# Altium project RX_BA_V4.PrjPcb
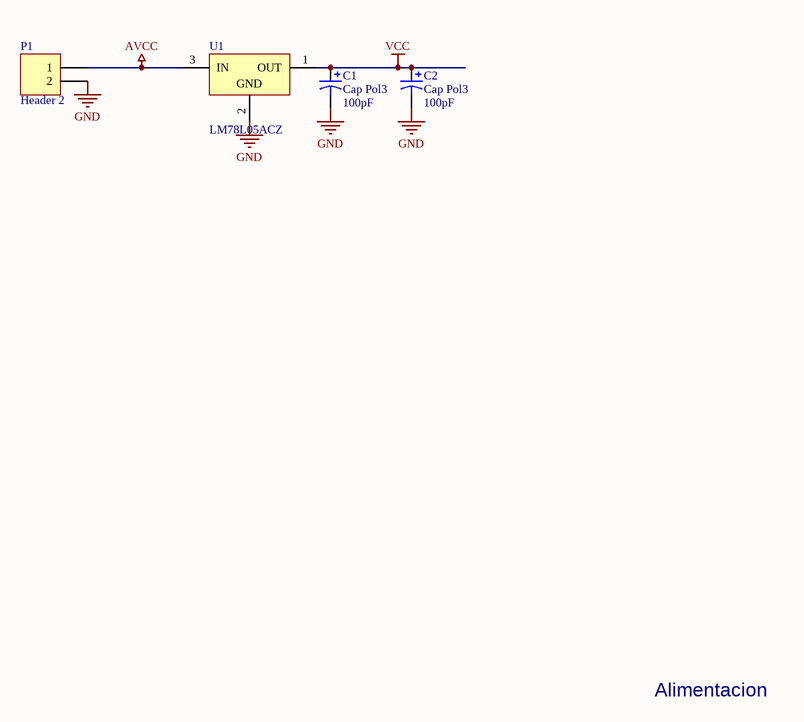
[diagram p0: Alimentacion.SchDoc]
Title: Receptor de Banda Aerea
8 sheets, 175 parts. Net scope: global (net labels, ports and power ports of the same name join across sheets).
Board file: RX_BA_v4.PcbDoc
Sheets:
  Alimentacion.SchDoc
  AmpliRF.SchDoc
  FiltroRF.SchDoc
  Mezclador1.SchDoc
  Mezclador2.SchDoc
  Ampli_FI2.SchDoc
  Ampli_audio.SchDoc
  Control_Freq.SchDoc

## Sheet Alimentacion.SchDoc: Receptor de Banda Aerea
size A4

### Parts
C1  Cap Pol3  value 100pF  [C0805]
C2  Cap Pol3  value 100pF  [C0805]
P1  Header 2  [HDR1X2]
U1  LM78L05ACZ  [BCY-W3]

### Nets
AVCC: P1.1 U1.3(IN)
GND: C1.2 C2.2 P1.2 U1.2(GND)
VCC: C1.1 C2.1 U1.1(OUT)

### Notes on the sheet
- Alimentacion

### Library data of the parts
C1 C2 = Cap Pol3: Polarized Capacitor (Surface Mount); Published: 8-Jun-2000; LatestRevisionDate: 17-Jul-2002; LatestRevisionNote: Re-released for DXP Platform.; PackageReference: C0805; Publisher: Altium Limited
P1 = Header 2: Header, 2-Pin; LatestRevisionDate: 17-Jul-2002; LatestRevisionNote: Re-released for DXP Platform.; Publisher: Altium Limited
U1 = LM78L05ACZ: 3-Terminal Positive Regulators; Manufacturer: National Semiconductor; CompType: LDO IC; PackageTopMarking: NSXYTT*LM78L*05ACZ; Published: 27-Nov-2008; DatasheetVersion: Apr-2006; PackageVersion: revG, Sep-2000; PackageReference: Z03A; Publisher: Altium Limited; PackageDescription: TO-92, Molded, 3 Lead; PartNumber: LM78L05ACZ; RoHS: O; PinCount: 3; DigiKeyPartNumber: LM78L05ACZNS-ND; Code_JEDEC: TO-226-AA; ComponentLink1Description: LM78L05 Datasheet; ComponentLink1URL: http://www.national.com/ds/LM/LM78L05.pdf; ComponentLink2Description: LM78L05 Web Page; ComponentLink2URL: http://www.national.com/pf/LM/LM78L05.html; ComponentLink3Description: Z03A Package Page; ComponentLink3URL: http://www.national.com/packaging/folders/z03a.html

## Sheet AmpliRF.SchDoc: Receptor de Banda Aerea
size A4
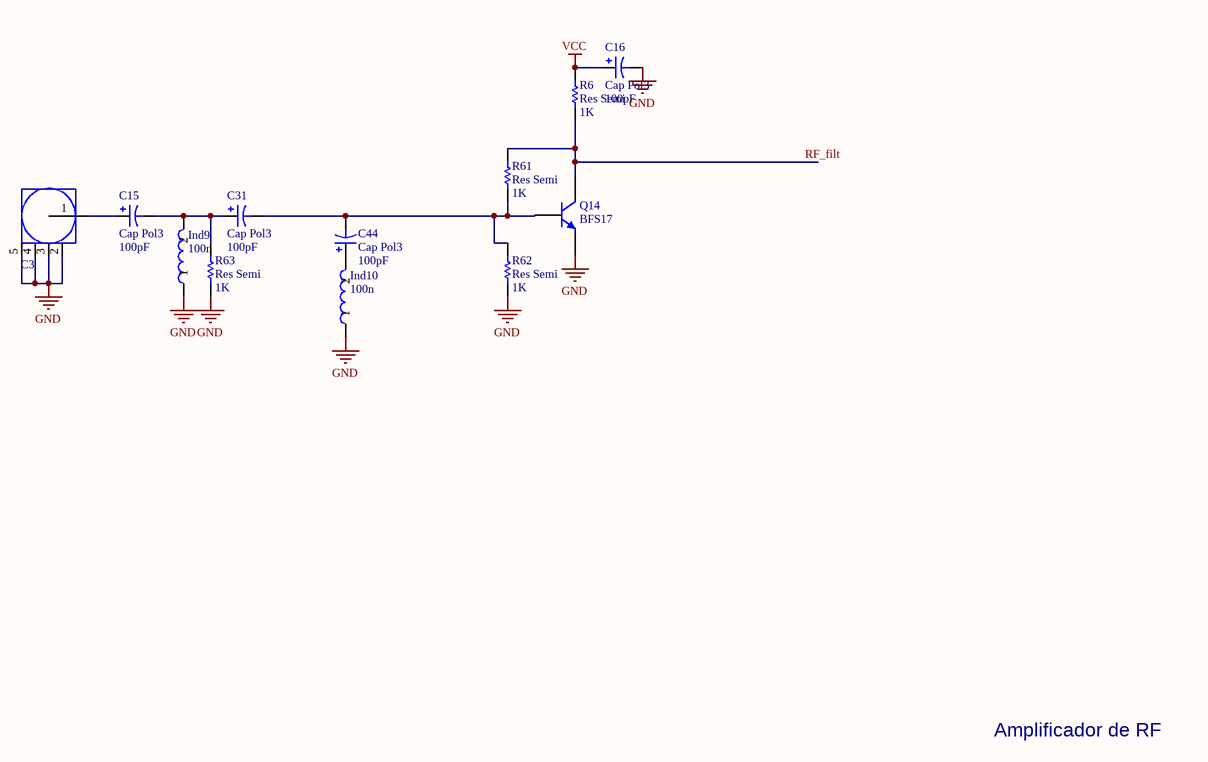
[diagram p1: AmpliRF.SchDoc]

### Parts
C3  SMA  [SMA1]  (value not drawn)
C15  Cap Pol3  value 100pF  [C0805]
C16  Cap Pol3  value 100pF  [C0805]
C31  Cap Pol3  value 100pF  [C0805]
C44  Cap Pol3  value 100pF  [C0805]
Ind9  Valor: 100n  [Ind_4mm]  (hidden comment: Ind2)
Ind10  Valor: 100n  [Ind_4mm]  (hidden comment: Ind2)
Q14  BFS17  [SOT-23]
R6  Res Semi  value 1K  [2012[0805]]
R61  Res Semi  value 1K  [2012[0805]]
R62  Res Semi  value 1K  [2012[0805]]
R63  Res Semi  value 1K  [2012[0805]]

### Nets
GND: C3.2(GND) C3.3(GND) C3.4(GND) C3.5(GND) C16.2 Ind9.1 Ind10.1 Q14.2(E) R62.2 R63.2
VCC: C16.1 R6.1
RF_filt: Q14.3(C) R6.2 R61.1
NetC3_1: C3.1(RF) C15.1
NetC15_2: C15.2 C31.1 Ind9.2 R63.1
NetC31_2: C31.2 C44.2 Q14.1(B) R61.2 R62.1
NetC44_1: C44.1 Ind10.2

### Notes on the sheet
- Amplificador de RF

### Library data of the parts
C15 C16 C31 C44 = Cap Pol3: Polarized Capacitor (Surface Mount); Published: 8-Jun-2000; LatestRevisionDate: 17-Jul-2002; LatestRevisionNote: Re-released for DXP Platform.; PackageReference: C0805; Publisher: Altium Limited
Q14 = BFS17: NPN 1 GHz Wideband Transistor; Published: 17-Sep-2003; LatestRevisionDate: 12-Dec-2006; LatestRevisionNote: IPC-7351 Footprint Added.; DatasheetVersion: Sep-1995; PackageVersion: May-1999; PackageReference: SOT23; Publisher: Altium Limited; PackageDescription: 3-Pin SOT-23 Package 0.95 mm Pitch, 2.3 mm Lead Span; ComponentLink1Description: Manufacturer Link; ComponentLink1URL: http://www.semiconductors.philips.com/; ComponentLink2Description: Datasheet; ComponentLink2URL: http://www.semiconductors.philips.com/acrobat/datasheets/BFS17_2.pdf
R6 R61-R63 = Res Semi: Semiconductor Resistor; Published: 8-Jun-2000; LatestRevisionDate: 17-Jul-2002; LatestRevisionNote: Re-released for DXP Platform.; PackageReference: AXIAL-0.5; Publisher: Altium Limited

## Sheet FiltroRF.SchDoc: Receptor de Banda Aerea
size A4
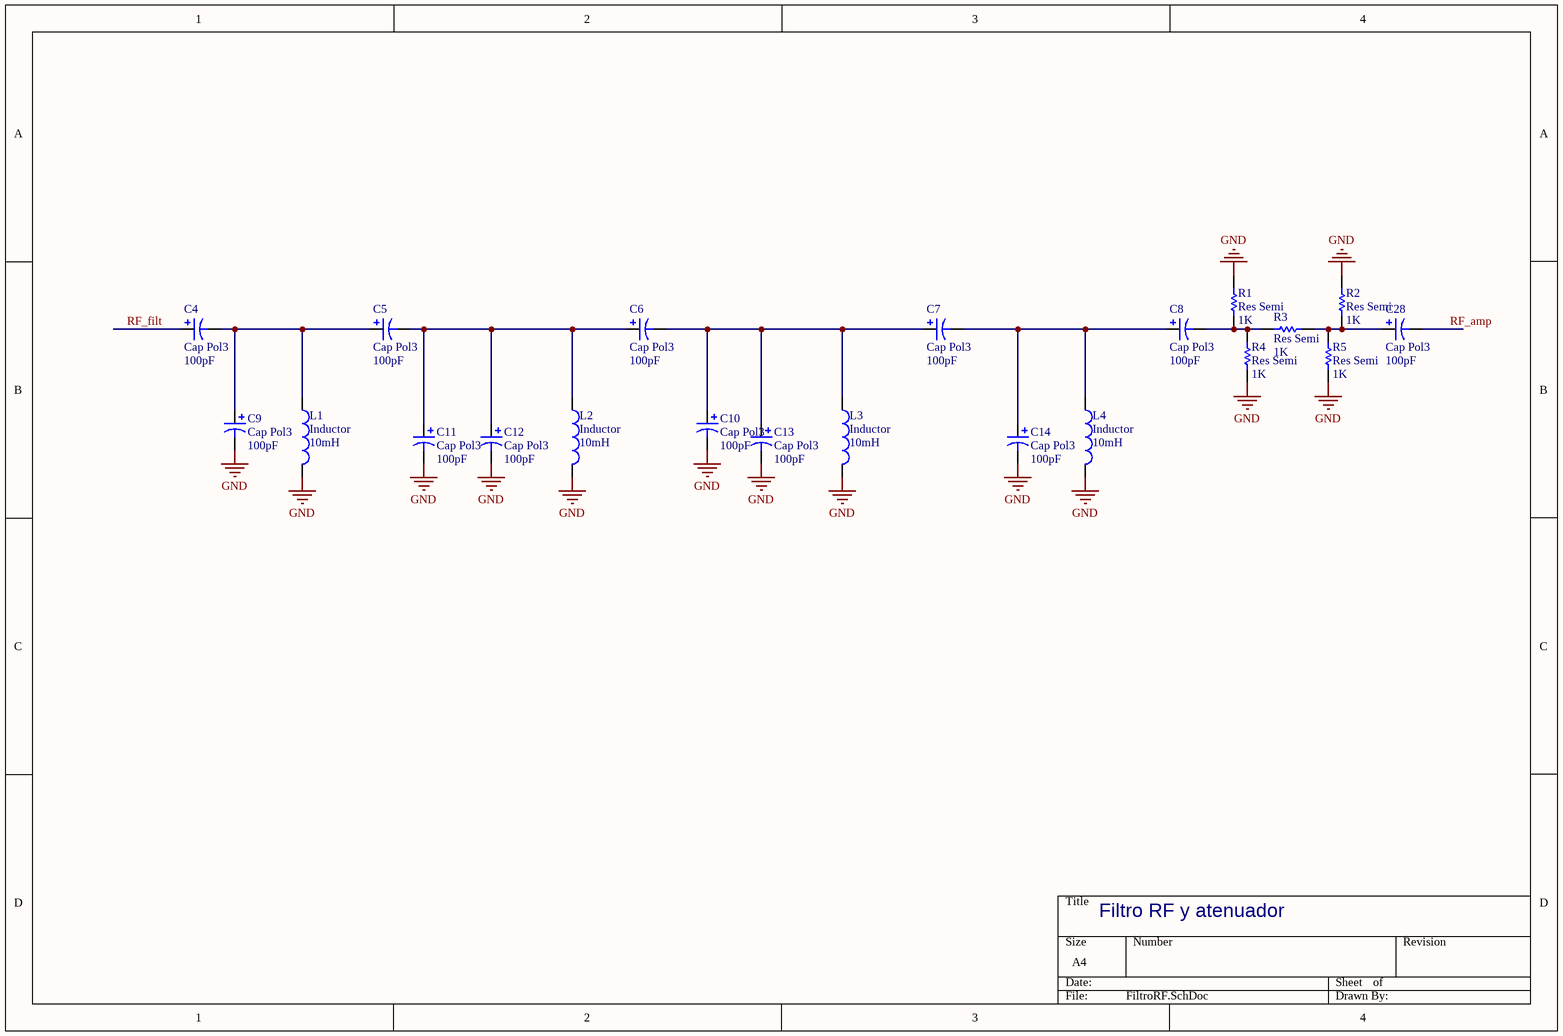
[diagram p2: FiltroRF.SchDoc]

### Parts
C4  Cap Pol3  value 100pF  [C0805]
C5  Cap Pol3  value 100pF  [C0805]
C6  Cap Pol3  value 100pF  [C0805]
C7  Cap Pol3  value 100pF  [C0805]
C8  Cap Pol3  value 100pF  [C0805]
C9  Cap Pol3  value 100pF  [C0805]
C10  Cap Pol3  value 100pF  [C0805]
C11  Cap Pol3  value 100pF  [C0805]
C12  Cap Pol3  value 100pF  [C0805]
C13  Cap Pol3  value 100pF  [C0805]
C14  Cap Pol3  value 100pF  [C0805]
C28  Cap Pol3  value 100pF  [C0805]
L1  Inductor  value 10mH  [3261]
L2  Inductor  value 10mH  [3261]
L3  Inductor  value 10mH  [3261]
L4  Inductor  value 10mH  [3261]
R1  Res Semi  value 1K  [2012[0805]]
R2  Res Semi  value 1K  [2012[0805]]
R3  Res Semi  value 1K  [2012[0805]]
R4  Res Semi  value 1K  [2012[0805]]
R5  Res Semi  value 1K  [2012[0805]]

### Nets
GND: C9.2 C10.2 C11.2 C12.2 C13.2 C14.2 L1.2 L2.2 L3.2 L4.2 R1.1 R2.1 R4.1 R5.1
RF_amp: C28.2
RF_filt: C4.1
NetC4_2: C4.2 C5.1 C9.1 L1.1
NetC5_2: C5.2 C6.1 C11.1 C12.1 L2.1
NetC6_2: C6.2 C7.1 C10.1 C13.1 L3.1
NetC7_2: C7.2 C8.1 C14.1 L4.1
NetC8_2: C8.2 R1.2 R3.2 R4.2
NetC28_1: C28.1 R2.2 R3.1 R5.2

### Notes on the sheet
- Filtro RF y atenuador

### Library data of the parts
C4-C14 C28 = Cap Pol3: Polarized Capacitor (Surface Mount); Published: 8-Jun-2000; LatestRevisionDate: 17-Jul-2002; LatestRevisionNote: Re-released for DXP Platform.; PackageReference: C0805; Publisher: Altium Limited
L1-L4 = Inductor: Code_IEC: 1005; Published: 8-Jun-2000; LatestRevisionDate: 17-Jul-2002; LatestRevisionNote: Re-released for DXP Platform.; PackageReference: 0402-A; Publisher: Altium Limited; Code_JEITA: 0402
R1-R5 = Res Semi: Semiconductor Resistor; Published: 8-Jun-2000; LatestRevisionDate: 17-Jul-2002; LatestRevisionNote: Re-released for DXP Platform.; PackageReference: AXIAL-0.5; Publisher: Altium Limited

## Sheet Mezclador1.SchDoc: Receptor de Banda Aerea
size A4
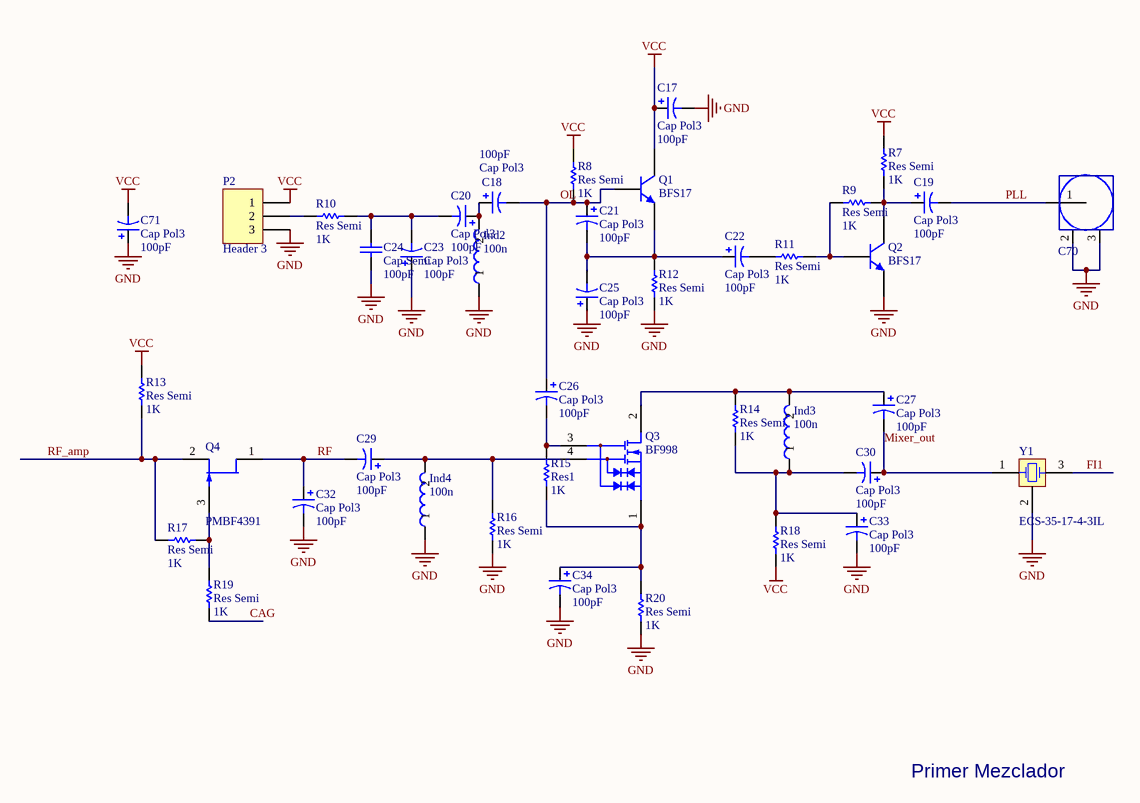
[diagram p3: Mezclador1.SchDoc]

### Parts
C17  Cap Pol3  value 100pF  [C0805]
C18  Cap Pol3  value 100pF  [C0805]
C19  Cap Pol3  value 100pF  [C0805]
C20  Cap Pol3  value 100pF  [C0805]
C21  Cap Pol3  value 100pF  [C0805]
C22  Cap Pol3  value 100pF  [C0805]
C23  Cap Pol3  value 100pF  [C0805]
C24  Cap Semi  value 100pF  [C1206]
C25  Cap Pol3  value 100pF  [C0805]
C26  Cap Pol3  value 100pF  [C0805]
C27  Cap Pol3  value 100pF  [C0805]
C29  Cap Pol3  value 100pF  [C0805]
C30  Cap Pol3  value 100pF  [C0805]
C32  Cap Pol3  value 100pF  [C0805]
C33  Cap Pol3  value 100pF  [C0805]
C34  Cap Pol3  value 100pF  [C0805]
C70  SMA_2  [SMA-2holeD]  (value not drawn)
C71  Cap Pol3  value 100pF  [C0805]
Ind2  Valor: 100n  [Ind_4mm]  (hidden comment: Ind2)
Ind3  Valor: 100n  [AXIAL-0.3]  (hidden comment: Ind2)
Ind4  Valor: 100n  [Ind_3mm]  (hidden comment: Ind2)
P2  Header 3  [HDR1X3]
Q1  BFS17  [SOT-23]
Q2  BFS17  [SOT23_N]
Q3  BF998  [SOT-143]
Q4  PMBF4391  [SOT-23]
R7  Res Semi  value 1K  [2012[0805]]
R8  Res Semi  value 1K  [2012[0805]]
R9  Res Semi  value 1K  [2012[0805]]
R10  Res Semi  value 1K  [2012[0805]]
R11  Res Semi  value 1K  [2012[0805]]
R12  Res Semi  value 1K  [2012[0805]]
R13  Res Semi  value 1K  [2012[0805]]
R14  Res Semi  value 1K  [2012[0805]]
R15  Res1  value 1K  [AXIAL-0.3]
R16  Res Semi  value 1K  [2012[0805]]
R17  Res Semi  value 1K  [2012[0805]]
R18  Res Semi  value 1K  [2012[0805]]
R19  Res Semi  value 1K  [2012[0805]]
R20  Res Semi  value 1K  [2012[0805]]
Y1  ECS-35-17-4-3IL  [HC-49US]

### Nets
GND: C17.2 C23.1 C24.2 C25.1 C32.2 C33.2 C34.2 C70.2(GND) C70.3(GND) C71.1 Ind2.1 Ind4.1 P2.3 Q2.2(E) R12.1 R16.1 R20.1 Y1.2(COM)
VCC: C17.1 C71.2 P2.1 Q1.3(C) R7.1 R8.2 R13.2 R18.1
CAG: R19.2
FI1: Y1.3(OSC2)
Mixer_out: C27.2 C30.1 Y1.1(OSC1)
OL: C18.2 C21.1 C26.1 Q1.1(B) R8.1
PLL: C19.2 C70.1(RF)
RF: C29.2 C32.1 Q4.1(D)
RF_amp: Q4.2(S) R13.1 R17.1
NetC18_1: C18.1 C20.1 Ind2.2
NetC19_1: C19.1 Q2.3(C) R7.2 R9.1
NetC20_2: C20.2 C23.2 C24.1 R10.2
NetC21_2: C21.2 C22.1 C25.2 Q1.2(E) R12.2
NetC22_2: C22.2 R11.2
NetC26_2: C26.2 Q3.3(G2) R15.2
NetC27_1: C27.1 Ind3.2 Q3.2(D) R14.2
NetC29_1: C29.1 Ind4.2 Q3.4(G1) R16.2
NetC30_2: C30.2 C33.1 Ind3.1 R14.1 R18.2
NetC34_1: C34.1 Q3.1(S) R15.1 R20.2
NetP2_2: P2.2 R10.1
NetQ2_1: Q2.1(B) R9.2 R11.1
NetQ4_3: Q4.3(G) R17.2 R19.1

### Notes on the sheet
- Primer Mezclador

### Library data of the parts
C17-C23 C25-C27 C29 C30 C32-C34 C71 = Cap Pol3: Polarized Capacitor (Surface Mount); Published: 8-Jun-2000; LatestRevisionDate: 17-Jul-2002; LatestRevisionNote: Re-released for DXP Platform.; PackageReference: C0805; Publisher: Altium Limited
C24 = Cap Semi: Capacitor (Semiconductor SIM Model); Published: 8-Jun-2000; LatestRevisionDate: 17-Jul-2002; LatestRevisionNote: Re-released for DXP Platform.; PackageReference: C1206; Publisher: Altium Limited
P2 = Header 3: Header, 3-Pin; LatestRevisionDate: 17-Jul-2002; LatestRevisionNote: Re-released for DXP Platform.; Publisher: Altium Limited
Q1 Q2 = BFS17: NPN 1 GHz Wideband Transistor; Published: 17-Sep-2003; LatestRevisionDate: 12-Dec-2006; LatestRevisionNote: IPC-7351 Footprint Added.; DatasheetVersion: Sep-1995; PackageVersion: May-1999; PackageReference: SOT23; Publisher: Altium Limited; PackageDescription: 3-Pin SOT-23 Package 0.95 mm Pitch, 2.3 mm Lead Span; ComponentLink1Description: Manufacturer Link; ComponentLink1URL: http://www.semiconductors.philips.com/; ComponentLink2Description: Datasheet; ComponentLink2URL: http://www.semiconductors.philips.com/acrobat/datasheets/BFS17_2.pdf
Q3 = BF998: Silicon N-channel Dual-gate MOSFET; Published: 17-Sep-2003; LatestRevisionDate: 12-Dec-2006; LatestRevisionNote: IPC-7351 Footprint Added.; DatasheetVersion: Aug-1996; PackageVersion: Sep-1996; PackageReference: SOT143; Publisher: Altium Limited; PackageDescription: 4-Pin SOT-143 Package 1.9 mm Pitch, 2.3 mm Lead Span; Code_IPC: SOT143; ComponentLink1Description: Manufacturer Link; ComponentLink1URL: http://www.semiconductors.philips.com/; ComponentLink2Description: Datasheet; ComponentLink2URL: http://www.semiconductors.philips.com/acrobat/datasheets/BF998_2.pdf
Q4 = PMBF4391: N-channel Silicon Junction Field-effect Transistor; Published: 17-Sep-2003; LatestRevisionDate: 12-Dec-2006; LatestRevisionNote: IPC-7351 Footprint Added.; DatasheetVersion: Apr-1995; PackageVersion: May-1999; PackageReference: SOT23; Publisher: Altium Limited; PackageDescription: 3-Pin SOT-23 Package 0.95 mm Pitch, 2.3 mm Lead Span; ComponentLink1Description: Manufacturer Link; ComponentLink1URL: http://www.semiconductors.philips.com/; ComponentLink2Description: Datasheet; ComponentLink2URL: http://www.semiconductors.philips.com/acrobat/datasheets/PMBF4391_4392_4393_CNV_2.pdf
R7-R14 R16-R20 = Res Semi: Semiconductor Resistor; Published: 8-Jun-2000; LatestRevisionDate: 17-Jul-2002; LatestRevisionNote: Re-released for DXP Platform.; PackageReference: AXIAL-0.5; Publisher: Altium Limited
R15 = Res1: Resistor; Published: 8-Jun-2000; LatestRevisionDate: 17-Jul-2002; LatestRevisionNote: Re-released for DXP Platform.; PackageReference: AXIAL-0.3; Publisher: Altium Limited
Y1 = ECS-35-17-4-3IL: Crystal Oscillator, 3rd In-Line Lead Version; Published: 17-Jul-2002; DatasheetDocument: 18-Apr-2000; PackageReference: HC-49US; Publisher: Altium Limited; ComponentLink1Description: Manufacturer Link; ComponentLink1URL: http://www.ecsxtal.com/; ComponentLink2Description: Datasheet; ComponentLink2URL: http://www.ecsxtal.com/pdf3/HC_49US.pdf

## Sheet Mezclador2.SchDoc: Receptor de Banda Aerea
size A4
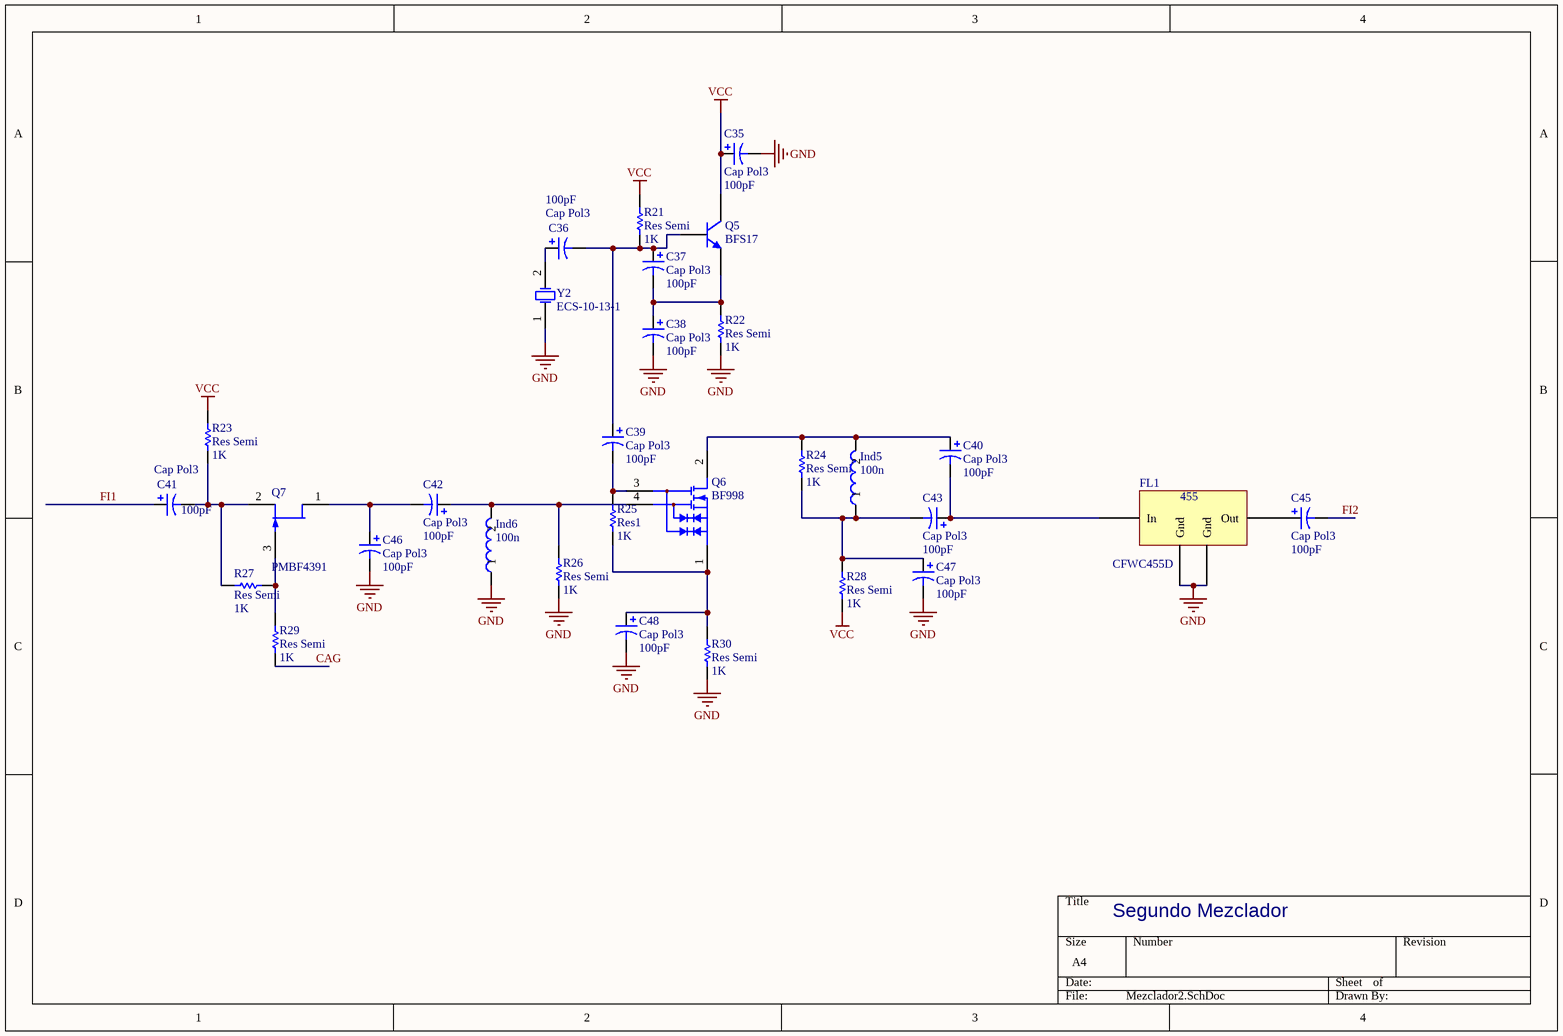
[diagram p4: Mezclador2.SchDoc]

### Parts
C35  Cap Pol3  value 100pF  [C0805]
C36  Cap Pol3  value 100pF  [C0805]
C37  Cap Pol3  value 100pF  [C0805]
C38  Cap Pol3  value 100pF  [C0805]
C39  Cap Pol3  value 100pF  [C0805]
C40  Cap Pol3  value 100pF  [C0805]
C41  Cap Pol3  value 100pF  [C0805]
C42  Cap Pol3  value 100pF  [C0805]
C43  Cap Pol3  value 100pF  [C0805]
C45  Cap Pol3  value 100pF  [C0805]
C46  Cap Pol3  value 100pF  [C0805]
C47  Cap Pol3  value 100pF  [C0805]
C48  Cap Pol3  value 100pF  [C0805]
FL1  CFWC455D  [CFWC455]
Ind5  Valor: 100n  [AXIAL-0.3]  (hidden comment: Ind2)
Ind6  Valor: 100n  [AXIAL-0.3]  (hidden comment: Ind2)
Q5  BFS17  [SOT-23]
Q6  BF998  [SOT-143]
Q7  PMBF4391  [SOT23_N]
R21  Res Semi  value 1K  [2012[0805]]
R22  Res Semi  value 1K  [2012[0805]]
R23  Res Semi  value 1K  [2012[0805]]
R24  Res Semi  value 1K  [2012[0805]]
R25  Res1  value 1K  [AXIAL-0.3]
R26  Res Semi  value 1K  [2012[0805]]
R27  Res Semi  value 1K  [2012[0805]]
R28  Res Semi  value 1K  [2012[0805]]
R29  Res Semi  value 1K  [2012[0805]]
R30  Res Semi  value 1K  [2012[0805]]
Y2  ECS-10-13-1  [HC-49U]

### Nets
GND: C35.2 C38.2 C46.2 C47.2 C48.2 FL1.3(Gnd) FL1.4(Gnd) Ind6.1 R22.1 R26.1 R30.1 Y2.1(OSC1)
VCC: C35.1 Q5.3(C) R21.2 R23.2 R28.1
CAG: R29.2
FI1: C41.1
FI2: C45.2
NetC36_1: C36.1 Y2.2(OSC2)
NetC36_2: C36.2 C37.1 C39.1 Q5.1(B) R21.1
NetC37_2: C37.2 C38.1 Q5.2(E) R22.2
NetC39_2: C39.2 Q6.3(G2) R25.2
NetC40_1: C40.1 Ind5.2 Q6.2(D) R24.2
NetC40_2: C40.2 C43.1 FL1.1(In)
NetC41_2: C41.2 Q7.2(S) R23.1 R27.1
NetC42_1: C42.1 Ind6.2 Q6.4(G1) R26.2
NetC42_2: C42.2 C46.1 Q7.1(D)
NetC43_2: C43.2 C47.1 Ind5.1 R24.1 R28.2
NetC45_1: C45.1 FL1.2(Out)
NetC48_1: C48.1 Q6.1(S) R25.1 R30.2
NetQ7_3: Q7.3(G) R27.2 R29.1

### Notes on the sheet
- Segundo Mezclador
- (in symbol CFWC455D3) 455

### Library data of the parts
C35-C43 C45-C48 = Cap Pol3: Polarized Capacitor (Surface Mount); Published: 8-Jun-2000; LatestRevisionDate: 17-Jul-2002; LatestRevisionNote: Re-released for DXP Platform.; PackageReference: C0805; Publisher: Altium Limited
FL1 = CFWC455D3: Filtro ceramico
Q5 = BFS17: NPN 1 GHz Wideband Transistor; Published: 17-Sep-2003; LatestRevisionDate: 12-Dec-2006; LatestRevisionNote: IPC-7351 Footprint Added.; DatasheetVersion: Sep-1995; PackageVersion: May-1999; PackageReference: SOT23; Publisher: Altium Limited; PackageDescription: 3-Pin SOT-23 Package 0.95 mm Pitch, 2.3 mm Lead Span; ComponentLink1Description: Manufacturer Link; ComponentLink1URL: http://www.semiconductors.philips.com/; ComponentLink2Description: Datasheet; ComponentLink2URL: http://www.semiconductors.philips.com/acrobat/datasheets/BFS17_2.pdf
Q6 = BF998: Silicon N-channel Dual-gate MOSFET; Published: 17-Sep-2003; LatestRevisionDate: 12-Dec-2006; LatestRevisionNote: IPC-7351 Footprint Added.; DatasheetVersion: Aug-1996; PackageVersion: Sep-1996; PackageReference: SOT143; Publisher: Altium Limited; PackageDescription: 4-Pin SOT-143 Package 1.9 mm Pitch, 2.3 mm Lead Span; Code_IPC: SOT143; ComponentLink1Description: Manufacturer Link; ComponentLink1URL: http://www.semiconductors.philips.com/; ComponentLink2Description: Datasheet; ComponentLink2URL: http://www.semiconductors.philips.com/acrobat/datasheets/BF998_2.pdf
Q7 = PMBF4391: as Q4 on sheet Mezclador1; Published: 17-Sep-2003; LatestRevisionDate: 12-Dec-2006; LatestRevisionNote: IPC-7351 Footprint Added.; DatasheetVersion: Apr-1995; PackageVersion: May-1999; PackageReference: SOT23; Publisher: Altium Limited; PackageDescription: 3-Pin SOT-23 Package 0.95 mm Pitch, 2.3 mm Lead Span; ComponentLink1Description: Manufacturer Link; ComponentLink1URL: http://www.semiconductors.philips.com/; ComponentLink2Description: Datasheet; ComponentLink2URL: http://www.semiconductors.philips.com/acrobat/datasheets/PMBF4391_4392_4393_CNV_2.pdf
R21-R24 R26-R30 = Res Semi: Semiconductor Resistor; Published: 8-Jun-2000; LatestRevisionDate: 17-Jul-2002; LatestRevisionNote: Re-released for DXP Platform.; PackageReference: AXIAL-0.5; Publisher: Altium Limited
R25 = Res1: Resistor; Published: 8-Jun-2000; LatestRevisionDate: 17-Jul-2002; LatestRevisionNote: Re-released for DXP Platform.; PackageReference: AXIAL-0.3; Publisher: Altium Limited
Y2 = ECS-10-13-1: Crystal Oscillator; Published: 17-Jul-2002; DatasheetDocument: 18-Apr-2000; PackageReference: HC-49U; Publisher: Altium Limited; ComponentLink1Description: Manufacturer Link; ComponentLink1URL: http://www.ecsxtal.com/; ComponentLink2Description: Datasheet; ComponentLink2URL: http://www.ecsxtal.com/pdf2/HC49U.PDF

## Sheet Ampli_FI2.SchDoc: Receptor de Banda Aerea
size A4
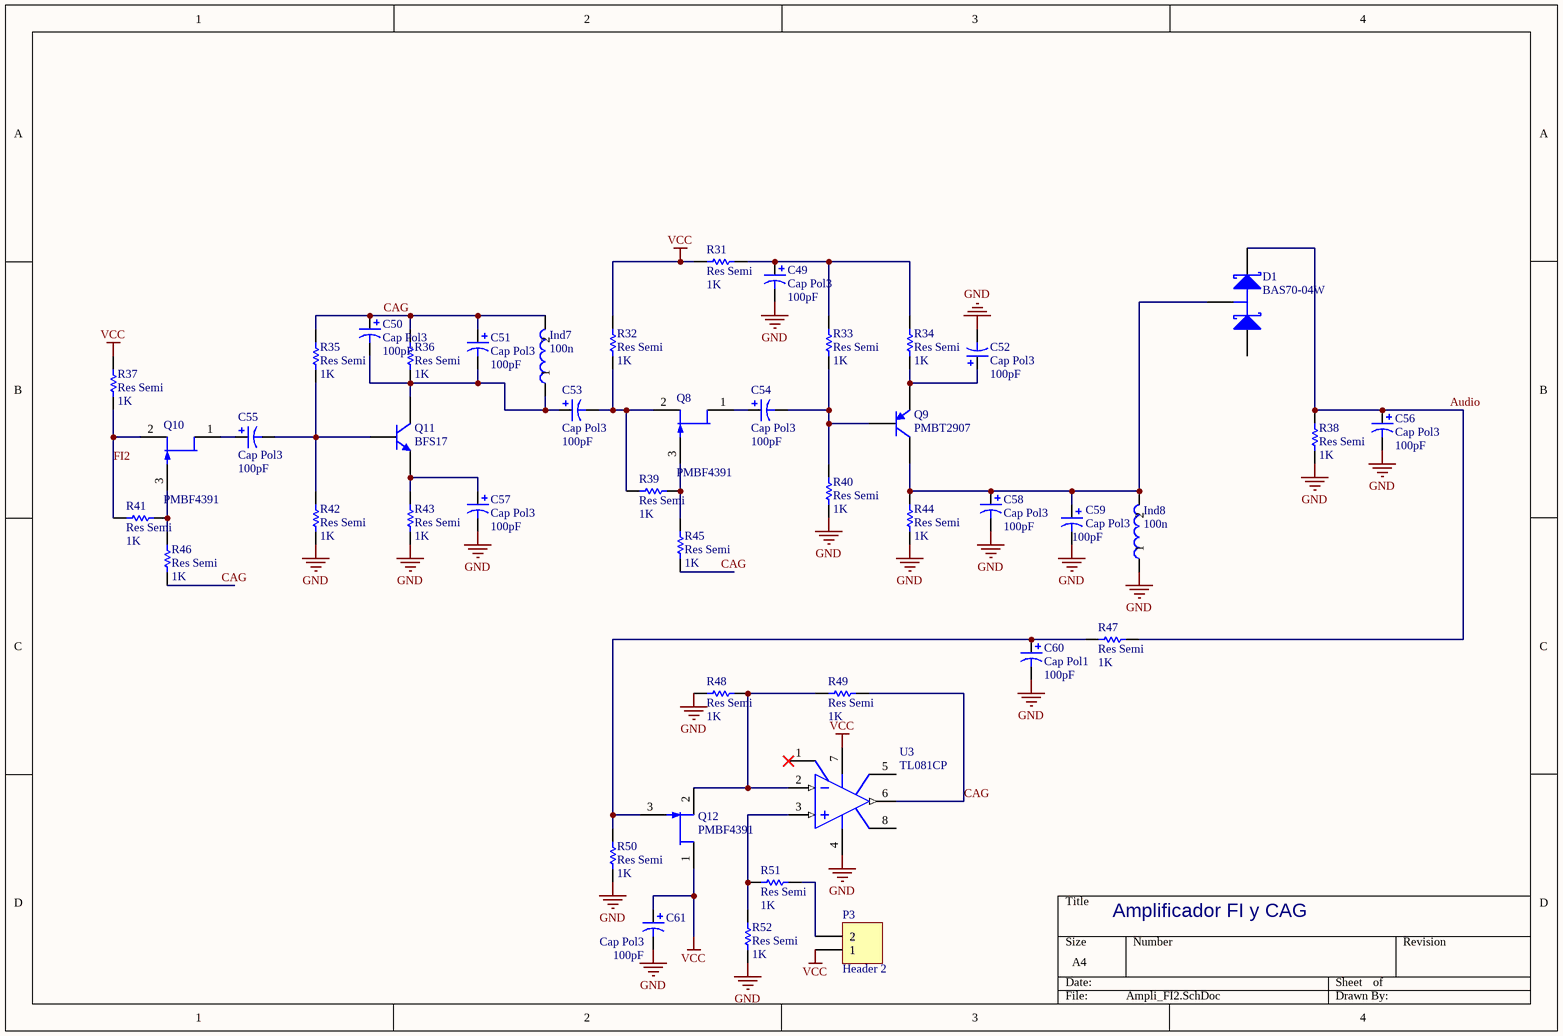
[diagram p5: Ampli_FI2.SchDoc]

### Parts
C49  Cap Pol3  value 100pF  [C0805]
C50  Cap Pol3  value 100pF  [C0805]
C51  Cap Pol3  value 100pF  [C0805]
C52  Cap Pol3  value 100pF  [C0805]
C53  Cap Pol3  value 100pF  [C0805]
C54  Cap Pol3  value 100pF  [C0805]
C55  Cap Pol3  value 100pF  [C0805]
C56  Cap Pol3  value 100pF  [C0805]
C57  Cap Pol3  value 100pF  [C0805]
C58  Cap Pol3  value 100pF  [C0805]
C59  Cap Pol3  value 100pF  [C0805]
C60  Cap Pol1  value 100pF  [B]
C61  Cap Pol3  value 100pF  [C0805]
D1  BAS70-04W  [SOT323_N]
Ind7  Valor: 100n  [AXIAL-0.3]  (hidden comment: Ind2)
Ind8  Valor: 100n  [AXIAL-0.3]  (hidden comment: Ind2)
P3  Header 2  [HDR1X2]
Q8  PMBF4391  [SOT-23]
Q9  PMBT2907  [SOT-23]
Q10  PMBF4391  [SOT-23]
Q11  BFS17  [SOT-23]
Q12  PMBF4391  [SOT-23]
R31  Res Semi  value 1K  [2012[0805]]
R32  Res Semi  value 1K  [2012[0805]]
R33  Res Semi  value 1K  [2012[0805]]
R34  Res Semi  value 1K  [2012[0805]]
R35  Res Semi  value 1K  [2012[0805]]
R36  Res Semi  value 1K  [2012[0805]]
R37  Res Semi  value 1K  [2012[0805]]
R38  Res Semi  value 1K  [2012[0805]]
R39  Res Semi  value 1K  [2012[0805]]
R40  Res Semi  value 1K  [2012[0805]]
R41  Res Semi  value 1K  [2012[0805]]
R42  Res Semi  value 1K  [2012[0805]]
R43  Res Semi  value 1K  [2012[0805]]
R44  Res Semi  value 1K  [2012[0805]]
R45  Res Semi  value 1K  [2012[0805]]
R46  Res Semi  value 1K  [2012[0805]]
R47  Res Semi  value 1K  [2012[0805]]
R48  Res Semi  value 1K  [2012[0805]]
R49  Res Semi  value 1K  [2012[0805]]
R50  Res Semi  value 1K  [2012[0805]]
R51  Res Semi  value 1K  [2012[0805]]
R52  Res Semi  value 1K  [2012[0805]]
U3  TL081CP  [DIP8]

### Nets
GND: C49.2 C52.2 C56.2 C57.2 C58.2 C59.2 C60.2 C61.2 Ind8.1 R38.1 R40.2 R42.1 R43.1 R44.2 R48.1 R50.2 R52.2 U3.4(V-)
VCC: C61.1 P3.1 Q12.1(D) R31.2 R32.2 R37.1 U3.7(V+)
Audio: C56.1 D1.2(K) R38.2 R47.1
CAG: C50.1 C51.1 Ind7.2 R35.2 R36.2 R45.2 R46.2 R49.2 U3.6(OUT)
FI2: Q10.2(S) R37.2 R41.1
NetC49_1: C49.1 R31.1 R33.1 R34.1
NetC50_2: C50.2 C51.2 C53.1 Ind7.1 Q11.3(C) R36.1
NetC52_1: C52.1 Q9.2(E) R34.2
NetC53_2: C53.2 Q8.2(S) R32.1 R39.1
NetC54_1: C54.1 Q8.1(D)
NetC54_2: C54.2 Q9.1(B) R33.2 R40.1
NetC55_1: C55.1 Q10.1(D)
NetC55_2: C55.2 Q11.1(B) R35.1 R42.2
NetC57_1: C57.1 Q11.2(E) R43.2
NetC58_1: C58.1 C59.1 D1.3(C) Ind8.2 Q9.3(C) R44.1
NetC60_1: C60.1 Q12.3(G) R47.2 R50.1
NetP3_2: P3.2 R51.1
NetQ8_3: Q8.3(G) R39.2 R45.1
NetQ10_3: Q10.3(G) R41.2 R46.1
NetQ12_2: Q12.2(S) R48.2 R49.1 U3.2(IN-)
NetR51_2: R51.2 R52.1 U3.3(IN+)

Not connected (* = marked no-connect by the designer): D1 1(A); U3 1(OS_NULL)* 5(OS_NULL) 8(NC)

### Notes on the sheet
- Amplificador FI y CAG

### Library data of the parts
C49-C59 C61 = Cap Pol3: Polarized Capacitor (Surface Mount); Published: 8-Jun-2000; LatestRevisionDate: 17-Jul-2002; LatestRevisionNote: Re-released for DXP Platform.; PackageReference: C0805; Publisher: Altium Limited
C60 = Cap Pol1: Polarized Capacitor (Radial); Published: 8-Jun-2000; LatestRevisionDate: 17-Jul-2002; LatestRevisionNote: Re-released for DXP Platform.; PackageReference: RB7.6-15; Publisher: Altium Limited
D1 = BAS70-04W: Schottky Barrier Double Diode; Published: 17-Sep-2003; LatestRevisionDate: 12-Dec-2006; LatestRevisionNote: IPC-7351 Footprint Added.; DatasheetVersion: 26-Mar-1999; PackageVersion: Apr-1999; PackageReference: SOT323; Publisher: Altium Limited; PackageDescription: 3-Pin SOT-323 Package 0.65 mm Pitch, 2.1 mm Lead Span; ComponentLink1Description: Manufacturer Link; ComponentLink1URL: http://www.semiconductors.philips.com/; ComponentLink2Description: Datasheet; ComponentLink2URL: http://www.semiconductors.philips.com/acrobat/datasheets/BAS70W_3.pdf
P3 = Header 2: Header, 2-Pin; LatestRevisionDate: 17-Jul-2002; LatestRevisionNote: Re-released for DXP Platform.; Publisher: Altium Limited
Q8 Q10 Q12 = PMBF4391: as Q4 on sheet Mezclador1; Published: 17-Sep-2003; LatestRevisionDate: 12-Dec-2006; LatestRevisionNote: IPC-7351 Footprint Added.; DatasheetVersion: Apr-1995; PackageVersion: May-1999; PackageReference: SOT23; Publisher: Altium Limited; PackageDescription: 3-Pin SOT-23 Package 0.95 mm Pitch, 2.3 mm Lead Span; ComponentLink1Description: Manufacturer Link; ComponentLink1URL: http://www.semiconductors.philips.com/; ComponentLink2Description: Datasheet; ComponentLink2URL: http://www.semiconductors.philips.com/acrobat/datasheets/PMBF4391_4392_4393_CNV_2.pdf
Q9 = PMBT2907: PNP Switching Transistor; Published: 17-Sep-2003; LatestRevisionDate: 12-Dec-2006; LatestRevisionNote: IPC-7351 Footprint Added.; DatasheetVersion: 27-Apr-1999; PackageVersion: May-1999; PackageReference: SOT23; Publisher: Altium Limited; PackageDescription: 3-Pin SOT-23 Package 0.95 mm Pitch, 2.3 mm Lead Span; ComponentLink1Description: Manufacturer Link; ComponentLink1URL: http://www.semiconductors.philips.com/; ComponentLink2Description: Datasheet; ComponentLink2URL: http://www.semiconductors.philips.com/acrobat/datasheets/PMBT2907_PMBT2907A_5.pdf
Q11 = BFS17: NPN 1 GHz Wideband Transistor; Published: 17-Sep-2003; LatestRevisionDate: 12-Dec-2006; LatestRevisionNote: IPC-7351 Footprint Added.; DatasheetVersion: Sep-1995; PackageVersion: May-1999; PackageReference: SOT23; Publisher: Altium Limited; PackageDescription: 3-Pin SOT-23 Package 0.95 mm Pitch, 2.3 mm Lead Span; ComponentLink1Description: Manufacturer Link; ComponentLink1URL: http://www.semiconductors.philips.com/; ComponentLink2Description: Datasheet; ComponentLink2URL: http://www.semiconductors.philips.com/acrobat/datasheets/BFS17_2.pdf
R31-R52 = Res Semi: Semiconductor Resistor; Published: 8-Jun-2000; LatestRevisionDate: 17-Jul-2002; LatestRevisionNote: Re-released for DXP Platform.; PackageReference: AXIAL-0.5; Publisher: Altium Limited
U3 = TL081CP: JFET-Input Operational Amplifier; Published: 17-Jul-2002; LatestRevisionDate: 06-Jun-2005; LatestRevisionNote: Stylized 3D Model Added.; DatasheetVersion: 1988; PackageReference: 626-05; Publisher: Altium Limited; PackageDescription: DIP; 8 Leads; Row Spacing 7.62 mm; Pitch 2.54 mm; ComponentLink1Description: Manufacturer Link; ComponentLink1URL: http://www.onsemi.com/site/products/parametrics/0,4446,251,00.html

## Sheet Ampli_audio.SchDoc: Receptor de Banda Aerea
size A4
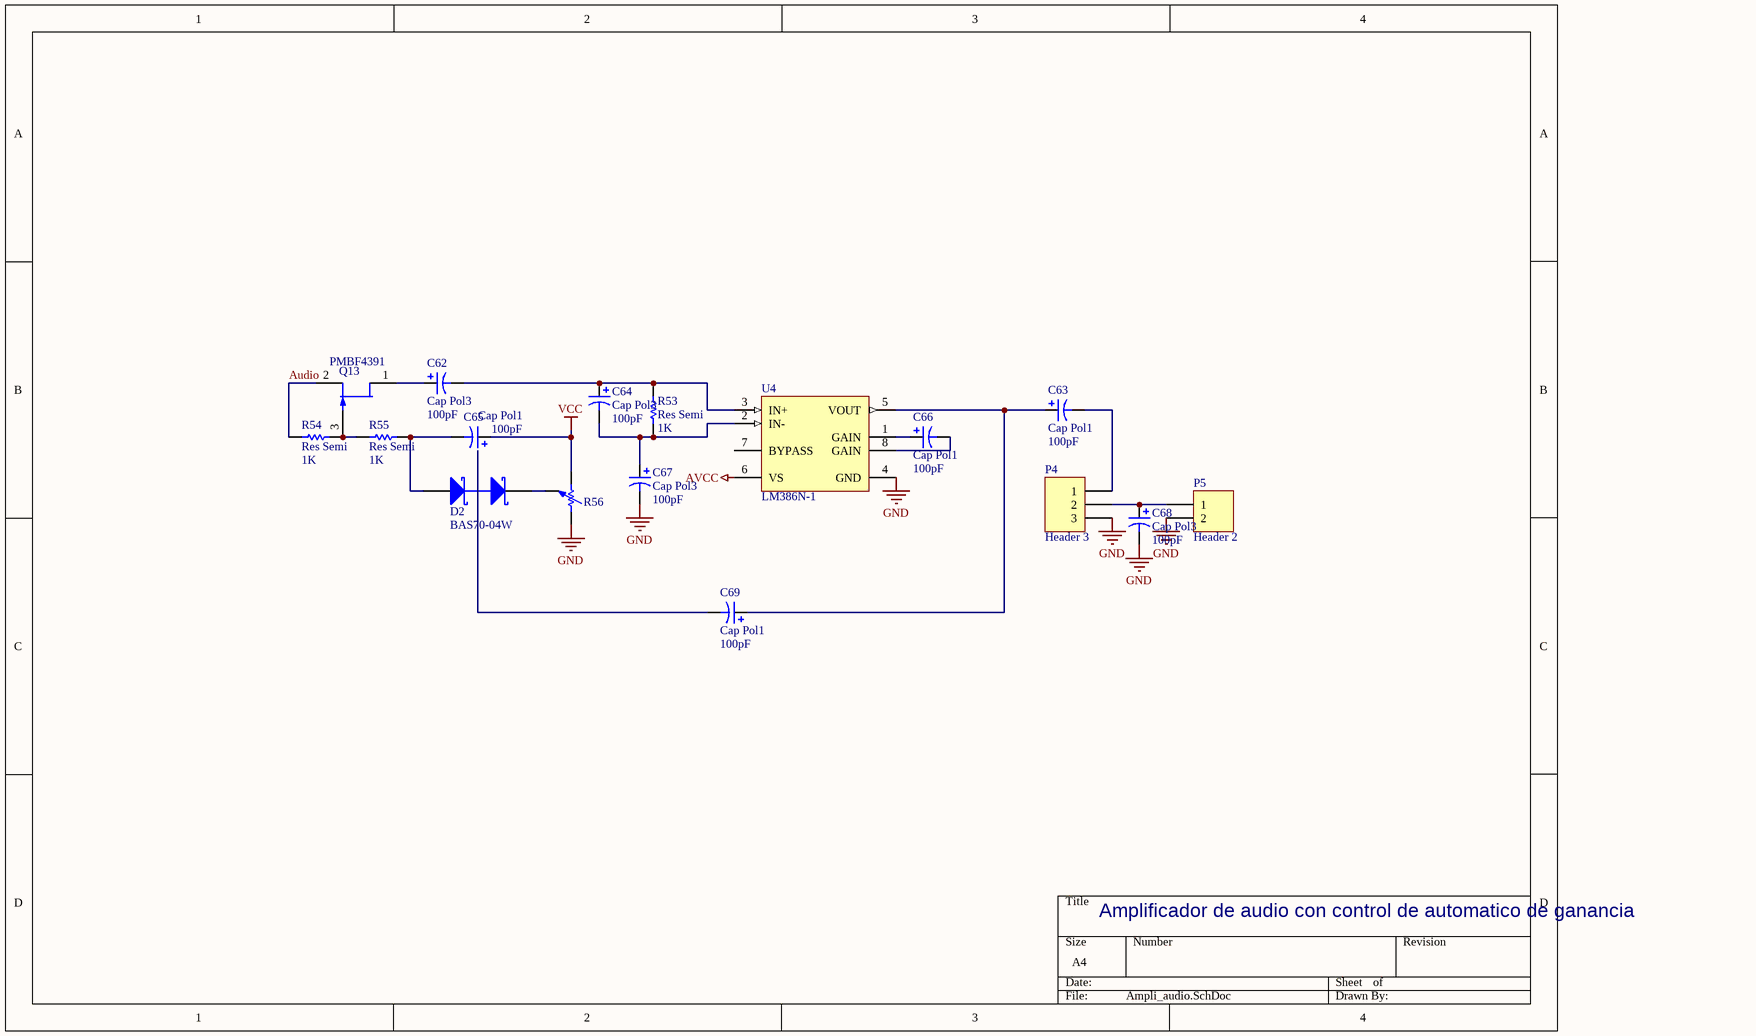
[diagram p6: Ampli_audio.SchDoc]

### Parts
C62  Cap Pol3  value 100pF  [C0805]
C63  Cap Pol1  value 100pF  [B]
C64  Cap Pol3  value 100pF  [C0805]
C65  Cap Pol1  value 100pF  [B]
C66  Cap Pol1  value 100pF  [B]
C67  Cap Pol3  value 100pF  [C0805]
C68  Cap Pol3  value 100pF  [C0805]
C69  Cap Pol1  value 100pF  [B]
D2  BAS70-04W  [SOT323_N]
P4  Header 3  [HDR1X3]
P5  Header 2  [HDR1X2]
Q13  PMBF4391  [SOT-23]
R53  Res Semi  value 1K  [2012[0805]]
R54  Res Semi  value 1K  [2012[0805]]
R55  Res Semi  value 1K  [2012[0805]]
R56  Pot  [Potenciometro]  (value not drawn)
U4  LM386N-1  [DIP8]

### Nets
AVCC: U4.6(VS)
GND: C67.2 C68.2 P4.3 P5.2 R56.1 U4.4(GND)
VCC: C65.1 R56.2
Audio: Q13.2(S) R54.1
NetC62_1: C62.1 Q13.1(D)
NetC62_2: C62.2 C64.1 R53.2 U4.3(IN+)
NetC63_1: C63.1 C69.1 U4.5(VOUT)
NetC63_2: C63.2 P4.1
NetC64_2: C64.2 C67.1 R53.1 U4.2(IN-)
NetC65_2: C65.2 D2.1(A) R55.2
NetC66_1: C66.1 U4.1(GAIN)
NetC66_2: C66.2 U4.8(GAIN)
NetC68_1: C68.1 P4.2 P5.1
NetC69_2: C69.2 D2.3(C)
NetD2_2: D2.2(K) R56.3
NetQ13_3: Q13.3(G) R54.2 R55.1

Not connected (* = marked no-connect by the designer): U4 7(BYPASS)

### Notes on the sheet
- Amplificador de audio con control de automatico de ganancia

### Library data of the parts
C62 C64 C67 C68 = Cap Pol3: Polarized Capacitor (Surface Mount); Published: 8-Jun-2000; LatestRevisionDate: 17-Jul-2002; LatestRevisionNote: Re-released for DXP Platform.; PackageReference: C0805; Publisher: Altium Limited
C63 C65 C66 C69 = Cap Pol1: Polarized Capacitor (Radial); Published: 8-Jun-2000; LatestRevisionDate: 17-Jul-2002; LatestRevisionNote: Re-released for DXP Platform.; PackageReference: RB7.6-15; Publisher: Altium Limited
D2 = BAS70-04W: Schottky Barrier Double Diode; Published: 17-Sep-2003; LatestRevisionDate: 12-Dec-2006; LatestRevisionNote: IPC-7351 Footprint Added.; DatasheetVersion: 26-Mar-1999; PackageVersion: Apr-1999; PackageReference: SOT323; Publisher: Altium Limited; PackageDescription: 3-Pin SOT-323 Package 0.65 mm Pitch, 2.1 mm Lead Span; ComponentLink1Description: Manufacturer Link; ComponentLink1URL: http://www.semiconductors.philips.com/; ComponentLink2Description: Datasheet; ComponentLink2URL: http://www.semiconductors.philips.com/acrobat/datasheets/BAS70W_3.pdf
P4 = Header 3: Header, 3-Pin; LatestRevisionDate: 17-Jul-2002; LatestRevisionNote: Re-released for DXP Platform.; Publisher: Altium Limited
P5 = Header 2: Header, 2-Pin; LatestRevisionDate: 17-Jul-2002; LatestRevisionNote: Re-released for DXP Platform.; Publisher: Altium Limited
Q13 = PMBF4391: as Q4 on sheet Mezclador1; Published: 17-Sep-2003; LatestRevisionDate: 12-Dec-2006; LatestRevisionNote: IPC-7351 Footprint Added.; DatasheetVersion: Apr-1995; PackageVersion: May-1999; PackageReference: SOT23; Publisher: Altium Limited; PackageDescription: 3-Pin SOT-23 Package 0.95 mm Pitch, 2.3 mm Lead Span; ComponentLink1Description: Manufacturer Link; ComponentLink1URL: http://www.semiconductors.philips.com/; ComponentLink2Description: Datasheet; ComponentLink2URL: http://www.semiconductors.philips.com/acrobat/datasheets/PMBF4391_4392_4393_CNV_2.pdf
R53-R55 = Res Semi: Semiconductor Resistor; Published: 8-Jun-2000; LatestRevisionDate: 17-Jul-2002; LatestRevisionNote: Re-released for DXP Platform.; PackageReference: AXIAL-0.5; Publisher: Altium Limited
U4 = LM386N-1: Low Voltage Audio Power Amplifier; Manufacturer: National Semiconductor; CompType: Audio IC; PackageTopMarking: NSUZXYTT*LM*386N-1; Published: 27-Nov-2008; DatasheetVersion: Aug-2000; PackageVersion: revG, May-2006; PackageReference: N08E; PackageDescription: MDIP, .365 x .250 x .130in, 8 Lead, .100in Pitch; PartNumber: LM386N-1; RoHS: O; PinCount: 8; DigiKeyPartNumber: LM386N-1-ND; Code_JEDEC: MS-001-BA; ComponentLink1Description: LM386 Datasheet; ComponentLink1URL: http://www.national.com/ds/LM/LM386.pdf; ComponentLink2Description: LM386 Web Page; ComponentLink2URL: http://www.national.com/pf/LM/LM386.html; ComponentLink3Description: N08E Package Page; ComponentLink3URL: http://www.national.com/packaging/folders/n08e.html

## Sheet Control_Freq.SchDoc: Control de Frecuencia
size A4
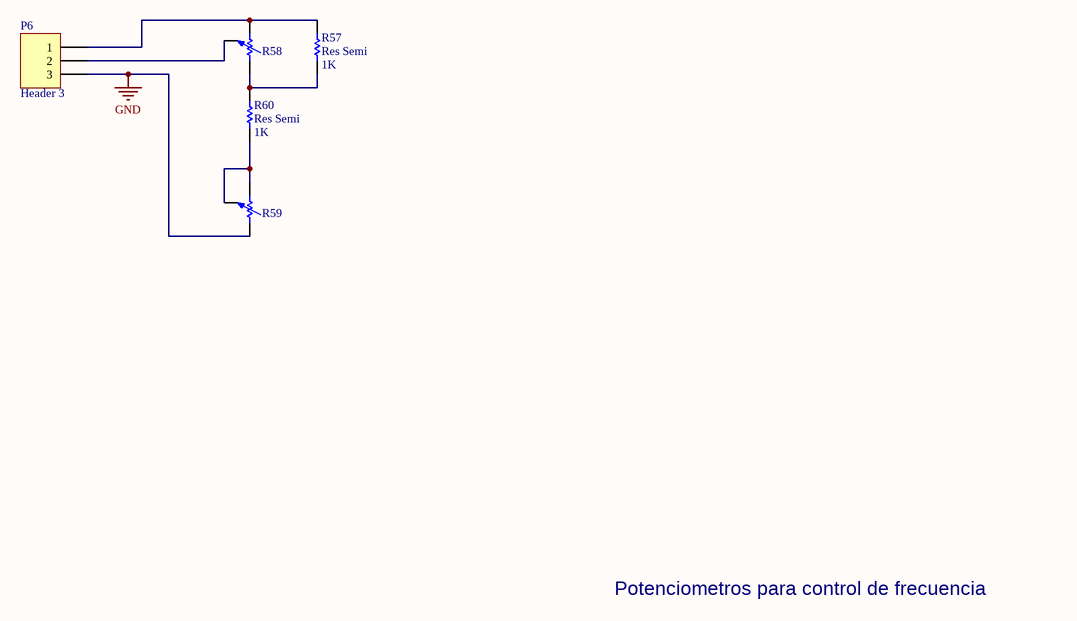
[diagram p7: Control_Freq.SchDoc]

### Parts
P6  Header 3  [HDR1X3]
R57  Res Semi  value 1K  [2012[0805]]
R58  Pot  [POT-eje2]  (value not drawn)
R59  Pot  [POT-eje2]  (value not drawn)
R60  Res Semi  value 1K  [2012[0805]]

### Nets
GND: P6.3 R59.1
NetP6_1: P6.1 R57.2 R58.2
NetP6_2: P6.2 R58.3
NetR57_1: R57.1 R58.1 R60.2
NetR59_2: R59.2 R59.3 R60.1

### Notes on the sheet
- Potenciometros para control de frecuencia

### Library data of the parts
P6 = Header 3: Header, 3-Pin; LatestRevisionDate: 17-Jul-2002; LatestRevisionNote: Re-released for DXP Platform.; Publisher: Altium Limited
R57 R60 = Res Semi: Semiconductor Resistor; Published: 8-Jun-2000; LatestRevisionDate: 17-Jul-2002; LatestRevisionNote: Re-released for DXP Platform.; PackageReference: AXIAL-0.5; Publisher: Altium Limited
R58 R59 = Pot: pin to pad: 2>3 3>2

## Nets that join several sheets
AVCC: Alimentacion (P1.1 U1.3), Ampli_audio (U4.6)
GND: Alimentacion (C1.2 C2.2 P1.2 U1.2), AmpliRF (10 pins), FiltroRF (14 pins), Mezclador1 (18 pins), Mezclador2 (12 pins), Ampli_FI2 (18 pins), Ampli_audio (6 pins), Control_Freq (P6.3 R59.1)
VCC: Alimentacion (C1.1 C2.1 U1.1), AmpliRF (C16.1 R6.1), Mezclador1 (8 pins), Mezclador2 (5 pins), Ampli_FI2 (7 pins), Ampli_audio (C65.1 R56.2)
Audio: Ampli_FI2 (C56.1 D1.2 R38.2 R47.1), Ampli_audio (Q13.2 R54.1)
CAG: Mezclador1 (R19.2), Mezclador2 (R29.2), Ampli_FI2 (9 pins)
FI1: Mezclador1 (Y1.3), Mezclador2 (C41.1)
FI2: Mezclador2 (C45.2), Ampli_FI2 (Q10.2 R37.2 R41.1)
RF_amp: FiltroRF (C28.2), Mezclador1 (Q4.2 R13.1 R17.1)
RF_filt: AmpliRF (Q14.3 R6.2 R61.1), FiltroRF (C4.1)